# EAGLE schematic smartDelayV2 (EAGLE 7.6.0)
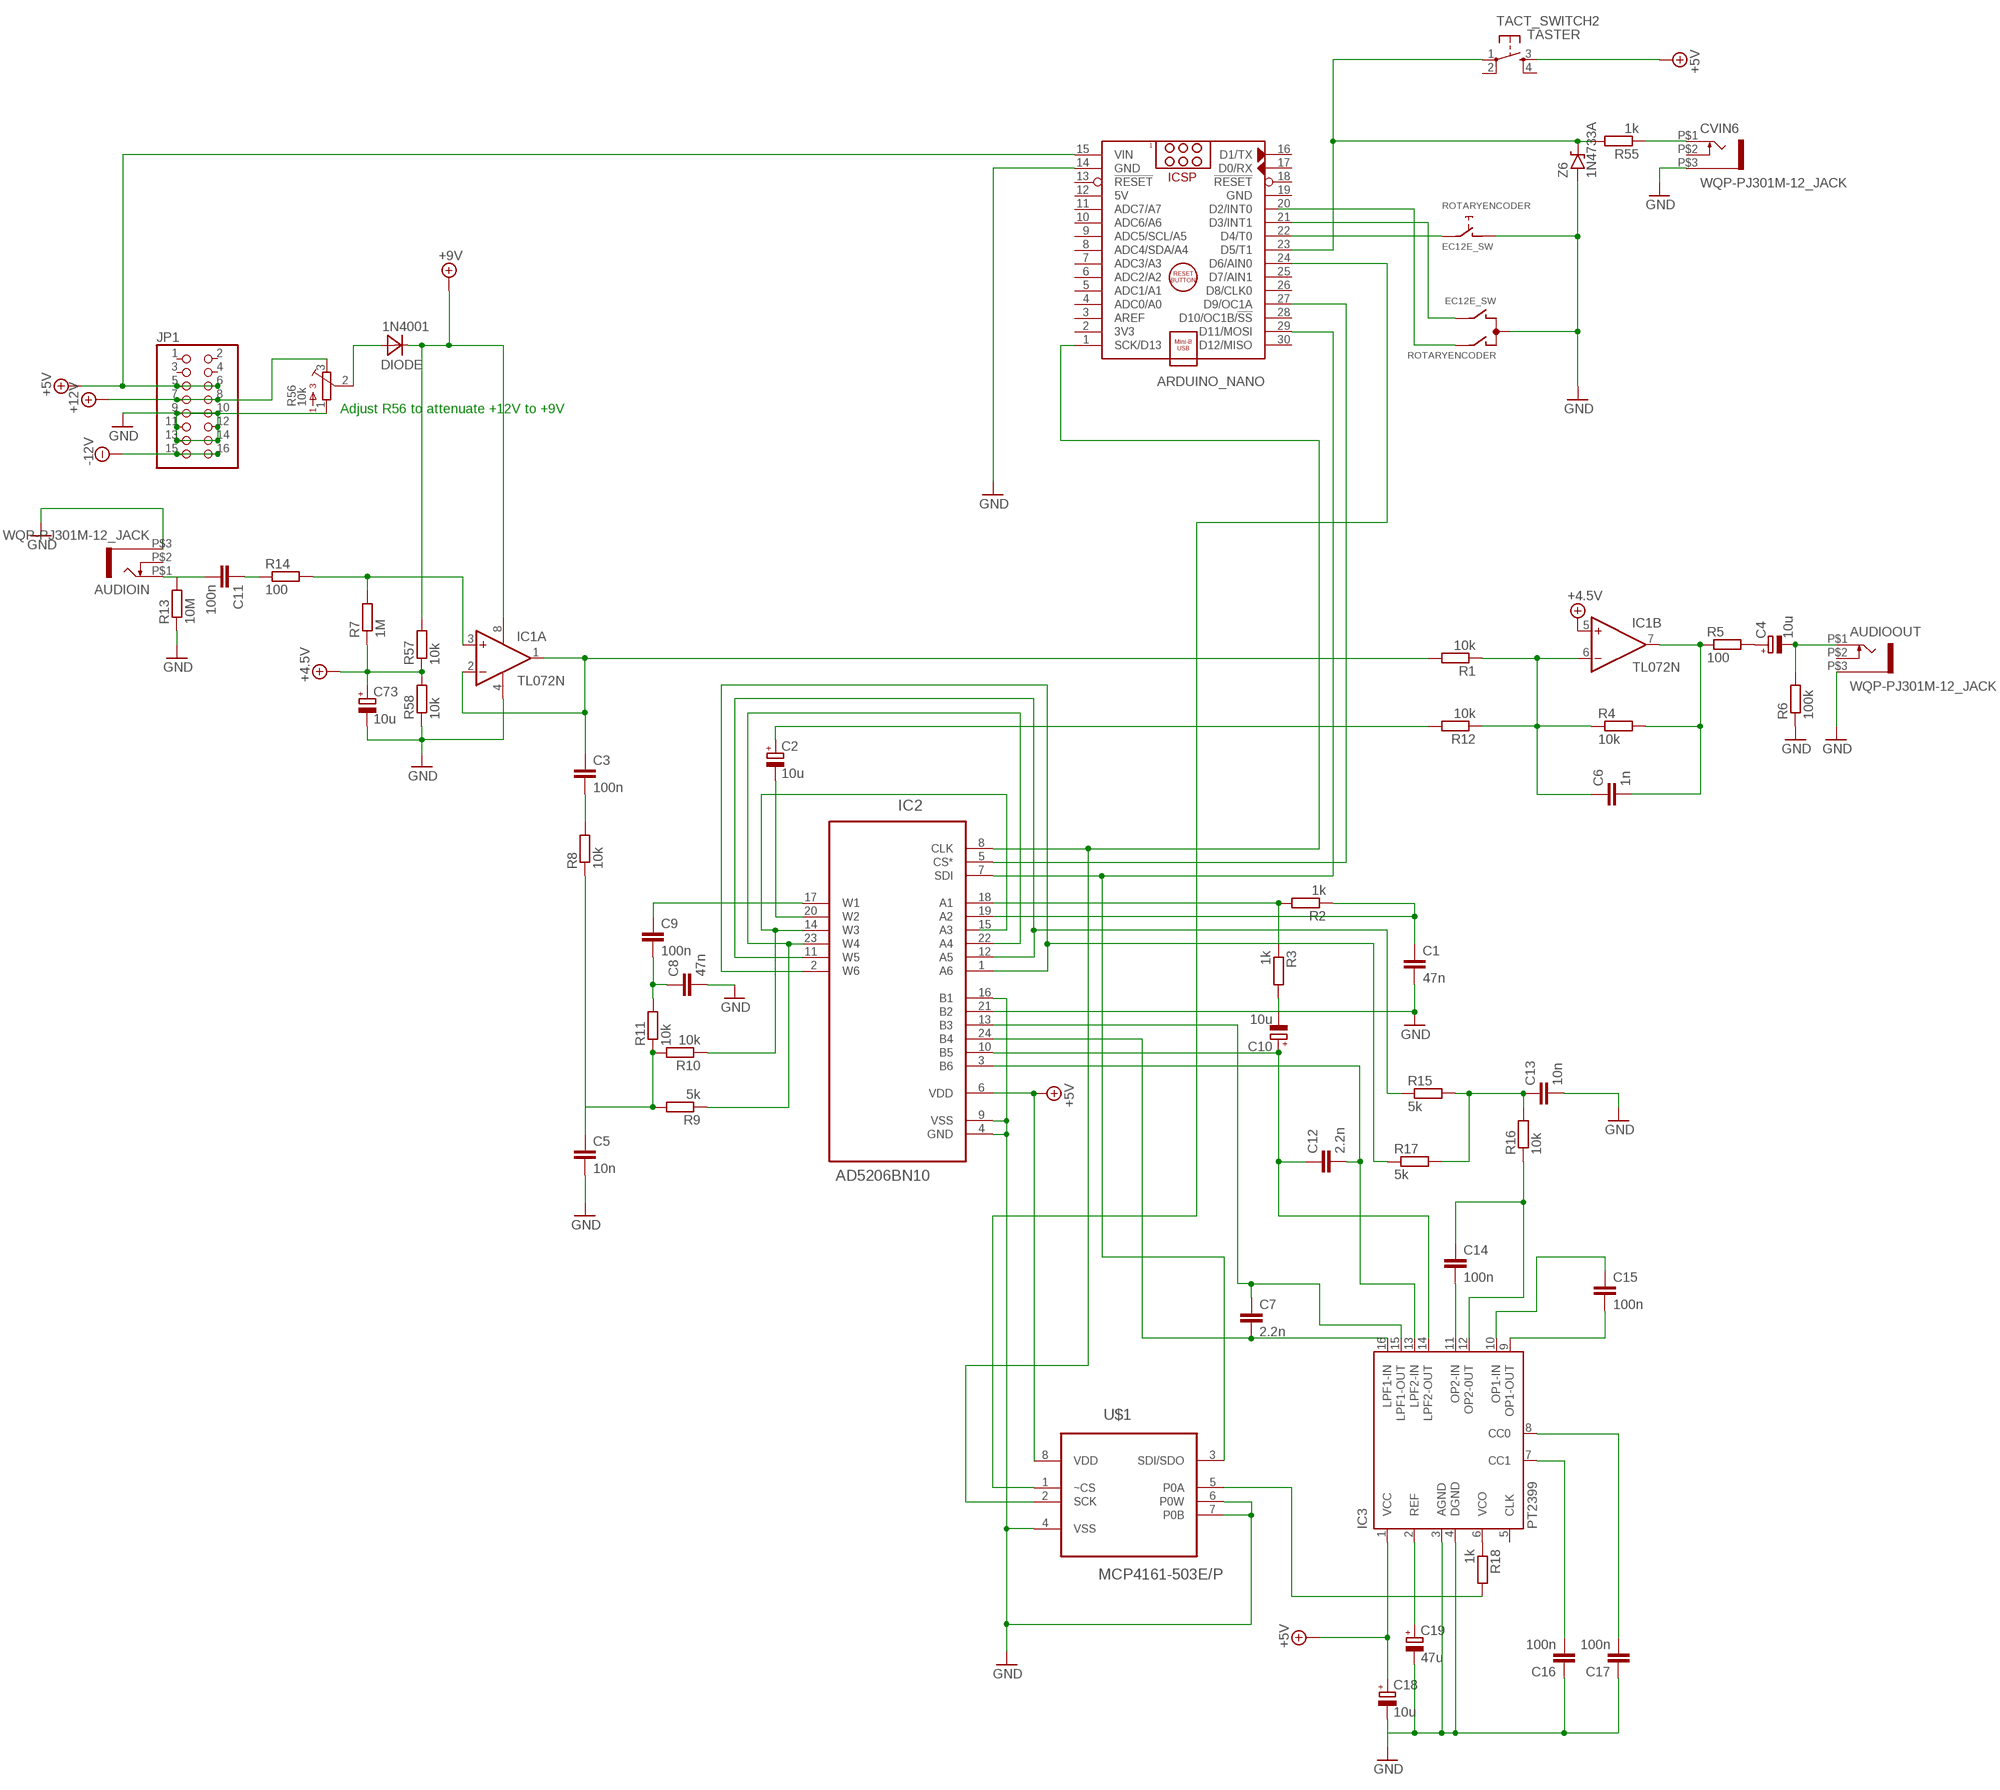
[diagram p0: schematic, sheet 1]

## Parts
1N4001  DIODE  [DO-35]
ARDUINO_NANO  ARDUINO_NANO  [ARDUINO_NANO]
AUDIOIN  WQP-PJ301M-12_JACK  [WQP-PJ301M-12_JACK]
AUDIOOUT  WQP-PJ301M-12_JACK  [WQP-PJ301M-12_JACK]
C1  47n  C-EUC1206  [C1206]
C2  10u  CPOL3  [E5-5]
C3  100n  C-EUC1206  [C1206]
C4  10u  CPOL3  [E5-5]
C5  10n  C-EUC1206  [C1206]
C6  1n  C-EUC1206  [C1206]
C7  2.2n  C-EUC1206  [C1206]
C8  47n  C-EUC1206  [C1206]
C9  100n  C-EUC1206  [C1206]
C10  10u  CPOL3  [E5-5]
C11  100n  C-EUC1206  [C1206]
C12  2.2n  C-EUC1206  [C1206]
C13  10n  C-EUC1206  [C1206]
C14  100n  C-EUC1206  [C1206]
C15  100n  C-EUC1206  [C1206]
C16  100n  C-EUC1206  [C1206]
C17  100n  C-EUC1206  [C1206]
C18  10u  CPOL3  [E5-5]
C19  47u  CPOL3  [E5-5]
C73  10u  CPOL3  [E5-5]
CVIN6  WQP-PJ301M-12_JACK  [WQP-PJ301M-12_JACK]
IC1  TL072N  [DIL8]
IC2  AD5206BN10  [DIP254P762X508-24P]
IC3  PT2399  [DIP16]
JP1  PINHD-2X8-BIG  [2X8]
R1  10k  R-EU_M1206  [M1206]
R2  1k  R-EU_M1206  [M1206]
R3  1k  R-EU_M1206  [M1206]
R4  10k  R-EU_M1206  [M1206]
R5  100  R-EU_M1206  [M1206]
R6  100k  R-EU_M1206  [M1206]
R7  1M  R-EU_M1206  [M1206]
R8  10k  R-EU_M1206  [M1206]
R9  5k  R-EU_M1206  [M1206]
R10  10k  R-EU_M1206  [M1206]
R11  10k  R-EU_M1206  [M1206]
R12  10k  R-EU_M1206  [M1206]
R13  10M  R-EU_M1206  [M1206]
R14  100  R-EU_M1206  [M1206]
R15  5k  R-EU_M1206  [M1206]
R16  10k  R-EU_M1206  [M1206]
R17  5k  R-EU_M1206  [M1206]
R18  1k  R-EU_M1206  [M1206]
R55  1k  R-EU_M1206  [M1206]
R56  10k  3362H  [3362H]
R57  10k  R-EU_M1206  [M1206]
R58  10k  R-EU_M1206  [M1206]
ROTARYENCODER  EC12E_SW  [ALPS_EC12E_SW]
TACT_SWITCH2  TASTER  [TASTER]
U$1  MCP4161-503E/P  [DIP254P762X533-8]
Z6  1N4733A  1N47XX2  [DO41-2]

## Nets
+4.1V: C73.+ IC1.5(B:+IN) R7.1 R57.1 R58.2 ; supply symbol labelled +4.5V
+5V: C18.+ IC2.6(VDD) IC3.1(VCC) TACT_SWITCH2.3(S) U$1.8(VDD)
+9V: 1N4001.- IC1.8(A:V+) R57.2
-12V: JP1.15 JP1.16
GND: ARDUINO_NANO.14(GND) AUDIOIN.P$3 AUDIOOUT.P$3 C1.2 C5.2 C8.2 C13.2 C16.1 C17.1 C18.- C19.- C73.- CVIN6.P$3 IC1.4(A:V-) IC2.4(GND) IC2.9(VSS) IC2.16(B1) IC2.21(B2) IC3.3(AGND) IC3.4(DGND) JP1.9 JP1.10 JP1.11 JP1.12 JP1.13 JP1.14 R6.1 R13.1 R56.1 R58.1 ROTARYENCODER.C ROTARYENCODER.D U$1.4(VSS) U$1.6(P0W) U$1.7(P0B) Z6.A
N$1: ARDUINO_NANO.1(SCK/D13) IC2.8(CLK) U$1.2(SCK)
N$2: C6.1 IC1.6(B:-IN) R1.1 R4.1 R12.1
N$3: C9.1 IC2.17(W1)
N$4: C8.1 C9.2 R11.2
N$5: C6.2 R4.2 R5.1
N$6: C4.+ R5.2
N$7: IC2.18(A1) R2.2 R3.1
N$8: C1.1 IC2.19(A2) R2.1
N$9: AUDIOOUT.P$1 C4.- R6.2
N$10: C3.2 R8.2
N$11: C7.2 IC2.24(B4) IC3.16(LPF1-IN)
N$12: C3.1 IC1.1(A:OUT) IC1.2(A:-IN) R1.2
N$13: C5.1 R8.1 R9.2 R10.2 R11.1
N$14: C10.- R3.2
N$15: ARDUINO_NANO.27(D9/OC1A) IC2.5(CS*)
N$16: C2.- IC2.20(W2)
N$17: C2.+ R12.2
N$18: C7.1 IC2.13(B3) IC3.15(LPF1-OUT)
N$19: IC2.11(W5) IC2.12(A5) R15.1
N$20: C13.1 R15.2 R16.2 R17.2
N$21: C12.2 IC2.3(B6) IC3.13(LPF2-IN)
N$22: C14.1 IC3.12(OP2-0UT) R16.1
N$23: C14.2 IC3.11(OP2-IN)
N$24: C15.1 IC3.10(OP1-IN)
N$25: C11.1 R14.1
N$26: IC1.3(A:+IN) R7.2 R14.2
N$27: C15.2 IC3.9(OP1-OUT)
N$28: ARDUINO_NANO.24(D6/AIN0) U$1.1(~CS)
N$29: C19.+ IC3.2(REF)
N$30: C16.2 IC3.7(CC1)
N$31: C17.2 IC3.8(CC0)
N$32: R18.2 U$1.5(P0A)
N$33: IC2.14(W3) R10.1
N$34: IC2.22(A4) IC2.23(W4) R9.1
N$35: IC3.6(VCO) R18.1
N$36: C10.+ C12.1 IC2.10(B5) IC3.14(LPF2-OUT)
N$37: IC2.1(A6) IC2.2(W6) R17.1
N$38: ARDUINO_NANO.22(D4/T0) ROTARYENCODER.E
N$39: ARDUINO_NANO.21(D3/INT1) ROTARYENCODER.B
N$40: ROTARYENCODER.A
N$72: ARDUINO_NANO.29(D11/MOSI) IC2.7(SDI) U$1.3(SDI/SDO)
N$120: AUDIOIN.P$1 C11.2 R13.2
N$127: CVIN6.P$1 R55.1
N$130: ARDUINO_NANO.23(D5/T1) R55.2 TACT_SWITCH2.1(P) Z6.C
V+: 1N4001.+ ARDUINO_NANO.15(VIN) JP1.5 JP1.6 JP1.7 JP1.8 R56.2 R56.3 ; supply symbol labelled +12V, +5V
Unconnected: ARDUINO_NANO.2(3V3) ARDUINO_NANO.3(AREF) ARDUINO_NANO.4(ADC0/A0) ARDUINO_NANO.5(ADC1/A1) ARDUINO_NANO.6(ADC2/A2) ARDUINO_NANO.7(ADC3/A3) ARDUINO_NANO.8(ADC4/SDA/A4) ARDUINO_NANO.9(ADC5/SCL/A5) ARDUINO_NANO.10(ADC6/A6) ARDUINO_NANO.11(ADC7/A7) ARDUINO_NANO.13(!RESET) ARDUINO_NANO.16(D1/TX) ARDUINO_NANO.17(D0/RX) ARDUINO_NANO.18(!RESET) ARDUINO_NANO.20(D2/INT0) ARDUINO_NANO.25(D7/AIN1) ARDUINO_NANO.26(D8/CLK0) ARDUINO_NANO.28(D10/OC1B/!SS) ARDUINO_NANO.30(D12/MISO) AUDIOIN.P$2 AUDIOOUT.P$2 CVIN6.P$2 IC1.7(B:OUT) IC2.15(A3) IC3.5(CLK) JP1.1 JP1.2 JP1.3 JP1.4 ROTARYENCODER.GND1(G) ROTARYENCODER.GND2(G) TACT_SWITCH2.2(P1) TACT_SWITCH2.4(S1)

## Notes on the sheet
- Adjust R56 to attenuate +12V to +9V

## Power pins joined to a net without a drawn wire
5V: ARDUINO_NANO.12(5V)
GND: ARDUINO_NANO.19(GND)

## Library data of the parts
1N4001 = Diodes:DIODE: Diode; SPICE: D{NAME} {+.NET} {-.NET} DIODE; SPICEMOD: .model DIODE D (N=0.001)
ARDUINO_NANO = ArduinoNanoV30:ARDUINO_NANO: Arduino Nano V3.0 Module Overview: The Arduino Nano is a small, complete, and breadboard-friendly board based on the ATmega328 (Arduino Nano 3.x) or ATmega168 (Arduino Nano 2.x). It has more or less the same functionality of the Arduino Duemilanove, but in a different package. It lacks only a DC power jack, and works with a Mini-B USB cable instead of a standard one. The Nano was designed and is being produced by Gravitech <http://www.gravitech.us/arna30wiatp.html>. General specifications: Item Value Microcontroller Atmel ATmega168 or ATmega328 Operating Voltage (logic level) 5 V Input Voltage (recommended) 7-12 V Input Voltage (limits) 6-20 V Digital I/O Pins 14 (of which 6 provide PWM output) Analog Input Pins 8 DC Current per I/O Pin 40 mA Flash Memory 16 KB (ATmega168) or 32 KB (ATmega328) of which 2 KB used by bootloader SRAM 1 KB (ATmega168) or 2 KB (ATmega328) EEPROM 512 bytes (ATmega168) or 1 KB (ATmega328) Clock Speed 16 MHz Dimensions 0.73" x 1.70" Length 45 mm Width 18 mm Weigth 5 g Power: The Arduino Nano can be powered via the Mini-B USB connection, 6-20V unregulated external power supply (pin 30), or 5V regulated external power supply (pin 27). The power source is automatically selected to the highest voltage source. Memory: The ATmega168 has 16 KB of flash memory for storing code (of which 2 KB is used for the bootloader); the ATmega328 has 32 KB, (also with 2 KB used for the bootloader). The ATmega168 has 1 KB of SRAM and 512 bytes of EEPROM (which can be read and written with the EEPROM library); the ATmega328 has 2 KB of SRAM and 1 KB of EEPROM. Input and Output: Each of the 14 digital pins on the Nano can be used as an input or output, using pinMode(), digitalWrite(), and digitalRead() functions. They operate at 5 volts. Each pin can provide or receive a maximum of 40 mA and has an internal pull-up resistor (disconnected by default) of 20-50 kOhms. In addition, some pins have specialized functions. Visit Arduino - ArduinoBoardNano <https://www.arduino.cc/en/Main/ArduinoBoardNano>
AUDIOIN AUDIOOUT CVIN6 = thonkiconn:WQP-PJ301M-12_JACK
C1 C3 C5-C9 C11-C17 = resistor:C-EU: CAPACITOR, European symbol
C2 C4 C10 C18 C19 C73 = ee2parts:CPOL: Electrolytic (polarised) capacitor
IC1 = ee2parts:TL072
IC2 = AD5206BN10:AD5206BN10: DIGITAL POTENTIOMETER (POTS) IC PDIP-24; MPN: AD5206BN10; OC_FARNELL: 2318572; OC_NEWARK: 98B7183; PACKAGE: PDIP-24; SUPPLIER: Analog Devices
IC3 = echounit:PT2399: Echo Processor IC
JP1 = pimoroni:PINHD-2X8: PIN HEADER
R1-R18 R55 R57 R58 = resistor:R-EU_: RESISTOR, European symbol
R56 = bourns:3362: 3362 Series 1/4" Square Trimmer
ROTARYENCODER = switch-alps:EC12E_SW: ALPS rotary Encoder EC12E series with switch; MPN: EC12E2424407; OC_FARNELL: 1520813; OC_NEWARK: 74M1068
TACT_SWITCH2 = switch-tact:TASTER
U$1 = MCP4161:MCP4161-503E/P: Digital POT; MPN: MCP4161-503E/P; OC_FARNELL: 1840820; OC_NEWARK: 77M2750; PACKAGE: DIP-8; SUPPLIER: Microchip
Z6 = gm-diodes:1N47XX: Zener Diode 1N4728 - 1N4764: 3.3 V - 100V, 10% (1n47xxA 5%); DO-41 glass case